# Altium schematic sheet Headphone Filter.SchDoc: TITLE
size A4; DrawnBy: D Kleiss; Organization: Flinders University; Address1: College of Science & Engineering; Address2: Engineering Services Room 3.22; Address3: 1284 South Rd; Address4: SA 5042; DocumentNumber: A4; Revision: 1; SheetNumber: 1; SheetTotal: 1
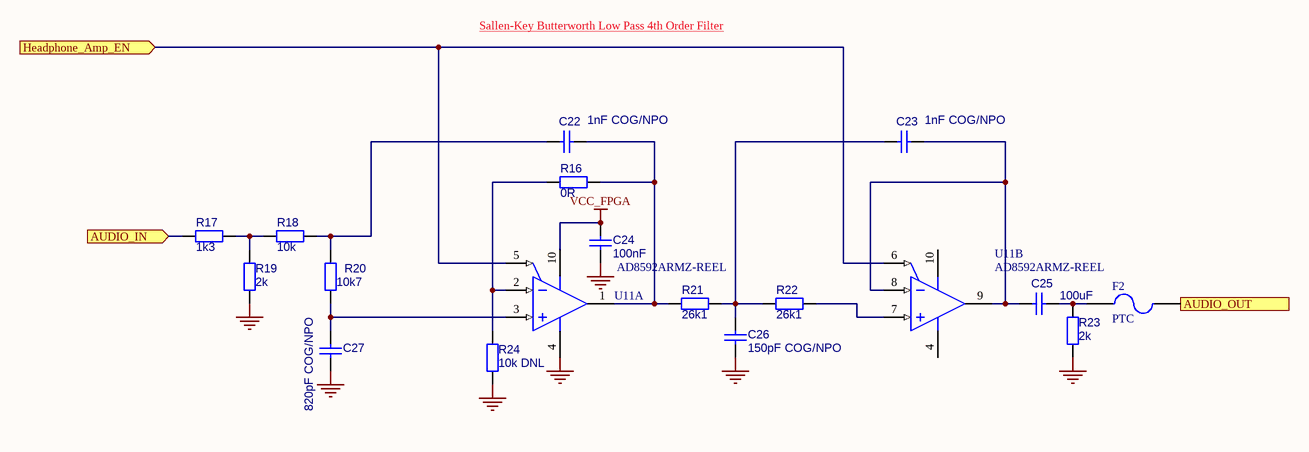
[diagram p0: Headphone Filter.SchDoc]

## Parts
C22  1nF COG/NPO  [0603_CAP PF HD]
C23  1nF COG/NPO  [0603_CAP PF HD]
C24  100nF  [0603_CAP UF HD]
C25  100uF  [1210-CAPACITOR UF]
C26  150pF COG/NPO  [0603_CAP PF HD]
C27  820pF COG/NPO  [0603_CAP PF HD]
F2  PTC  [0603-RESISTOR HD]
R16  0R  [0603-RESISTOR HD]
R17  1k3  [0603-RESISTOR HD]
R18  10k  [0603-RESISTOR HD]
R19  2k  [0603-RESISTOR HD]
R20  10k7  [0603-RESISTOR HD]
R21  26k1  [0603-RESISTOR HD]
R22  26k1  [0603-RESISTOR HD]
R23  2k  [0603-RESISTOR HD]
R24  10k DNL  [0603-RESISTOR HD]
U11  AD8592ARMZ-REEL  [ADI-RM-10_M]  (parts A,B of 2)

## Ports
AUDIO_IN (in), AUDIO_OUT (out), Headphone_Amp_EN (in)

## Nets
GND: C24.2 C26.1 C27.2 R19.2 R23.2 R24.2 U11.4(-V)
VCC_FPGA: C24.1 U11.10(+V)
AUDIO_IN: R17.2 ; port AUDIO_IN
AUDIO_OUT: F2.2 ; port AUDIO_OUT
Headphone_Amp_EN: U11.5(~{SDA}) U11.6(~{SDB}) ; port Headphone_Amp_EN
NetC22_1: C22.1 R18.2 R20.2
NetC22_2: C22.2 R16.1 R21.2 U11.1(OUT_A)
NetC23_1: C23.1 C26.2 R21.1 R22.1
NetC23_2: C23.2 C25.1 U11.8(-IN_B) U11.9(OUT_B)
NetC25_2: C25.2 F2.1 R23.1
NetC27_1: C27.1 R20.1 U11.3(+IN_A)
NetR16_2: R16.2 R24.1 U11.2(-IN_A)
NetR17_1: R17.1 R18.1 R19.1
NetR22_2: R22.2 U11.7(+IN_B)

## Notes on the sheet
- Sallen-Key Butterworth Low Pass 4th Order Filter
- Title
- Size:
- Date:
- A4
- Number:
- Revision:
- Sheet
- Drawn By:
- of
- File:

## Library data of the parts
C22 C23 = Cap: Capacitor; Manufacturer: Wurth Electronics Inc.; Manufacturer Number: 885012006029; Value: 1nF COG/NPO; Digikey Number: 732-7771-1-ND
C24 C26 C27 = Cap: Capacitor
  C24: Value: 100nF
  C26: Value: 150pF COG/NPO
  C27: Value: 820pF COG/NPO; Digikey Number: 732-7771-1-ND
C25 = Cap: Capacitor; Manufacturer: Taiyo Yuden; Manufacturer Number: LMK325BJ107MM-T; Value: 100uF; Digikey Number: 587-1965-1-ND
F2 = Fuse: Manufacturer: Murata Electronics; Manufacturer Number: PRG18BB330MB1RB; Digikey Number: 490-2471-1-ND
R16-R24 = Resistor
  R16: Value: 0R
  R17: Value: 1k3
  R18: Value: 10k
  R19 R23: Value: 2k
  R20: Value: 10k7
  R21 R22: Value: 26k1
  R24: Value: 10k DNL
U11 = AD8592ARMZ-REEL: Double Channel Wide Bandwidth Operational Amplifier, 2.2 MHz BW, 3.5 V/us SR, Industrial, 10-pin SOP (RM-10), Reel; Manufacturer: Analog Devices; Digikey Number: AD8592ARMZ-REELCT-ND; Manufacturer Number: AD8592ARMZ-REEL